# Altium schematic sheet IO.SchDoc
size A3; SheetNumber: 11; SheetTotal: 13
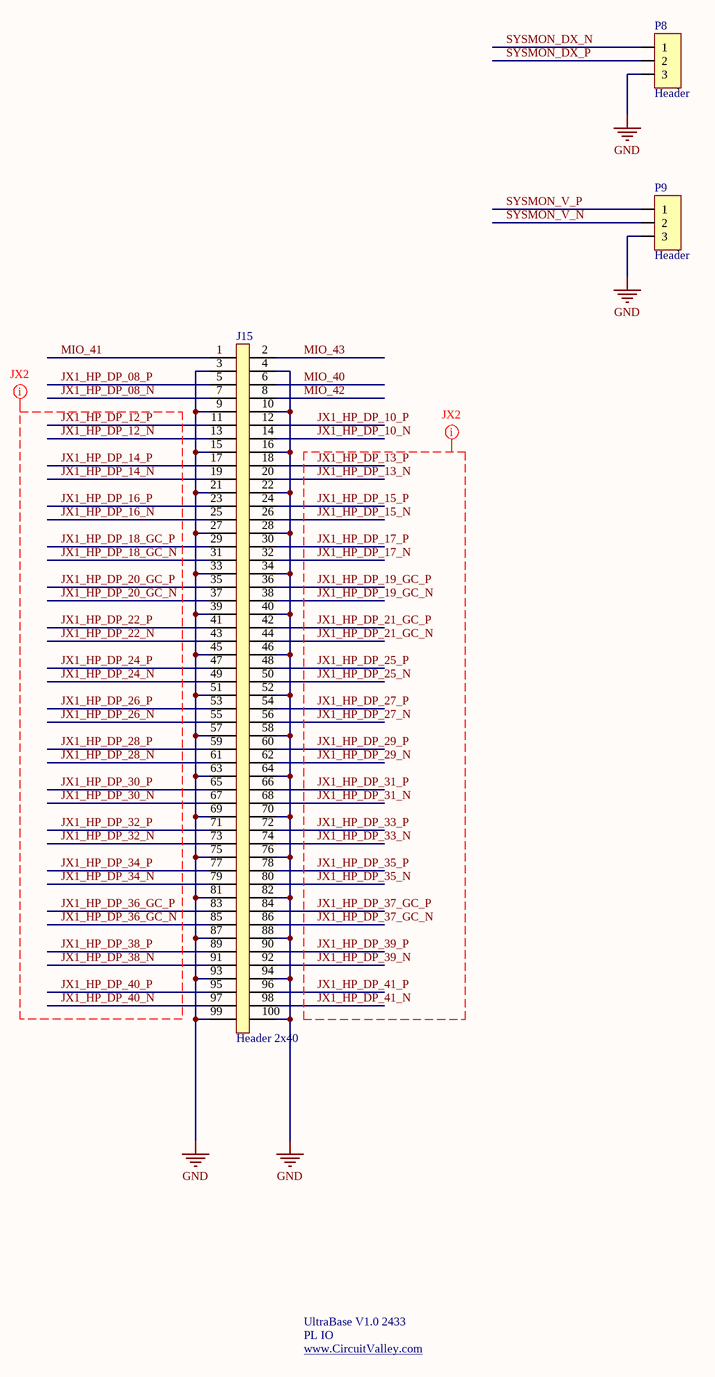
[diagram p0: IO.SchDoc]

## Parts
J15  Header 2x40  [Header_2x50]
P8  Header  [Header3x]
P9  Header  [Header3x]

## Nets
GND: J15.3 J15.4 J15.9 J15.10 J15.15 J15.16 J15.21 J15.22 J15.27 J15.28 J15.33 J15.34 J15.39 J15.40 J15.45 J15.46 J15.51 J15.52 J15.57 J15.58 J15.63 J15.64 J15.69 J15.70 J15.75 J15.76 J15.81 J15.82 J15.87 J15.88 J15.93 J15.94 J15.99 J15.100 P8.3 P9.3
JX1_HP_DP_08_N: J15.7
JX1_HP_DP_08_P: J15.5
JX1_HP_DP_10_N: J15.14
JX1_HP_DP_10_P: J15.12
JX1_HP_DP_12_N: J15.13
JX1_HP_DP_12_P: J15.11
JX1_HP_DP_13_N: J15.20
JX1_HP_DP_13_P: J15.18
JX1_HP_DP_14_N: J15.19
JX1_HP_DP_14_P: J15.17
JX1_HP_DP_15_N: J15.26
JX1_HP_DP_15_P: J15.24
JX1_HP_DP_16_N: J15.25
JX1_HP_DP_16_P: J15.23
JX1_HP_DP_17_N: J15.32
JX1_HP_DP_17_P: J15.30
JX1_HP_DP_18_GC_N: J15.31
JX1_HP_DP_18_GC_P: J15.29
JX1_HP_DP_19_GC_N: J15.38
JX1_HP_DP_19_GC_P: J15.36
JX1_HP_DP_20_GC_N: J15.37
JX1_HP_DP_20_GC_P: J15.35
JX1_HP_DP_21_GC_N: J15.44
JX1_HP_DP_21_GC_P: J15.42
JX1_HP_DP_22_N: J15.43
JX1_HP_DP_22_P: J15.41
JX1_HP_DP_24_N: J15.49
JX1_HP_DP_24_P: J15.47
JX1_HP_DP_25_N: J15.50
JX1_HP_DP_25_P: J15.48
JX1_HP_DP_26_N: J15.55
JX1_HP_DP_26_P: J15.53
JX1_HP_DP_27_N: J15.56
JX1_HP_DP_27_P: J15.54
JX1_HP_DP_28_N: J15.61
JX1_HP_DP_28_P: J15.59
JX1_HP_DP_29_N: J15.62
JX1_HP_DP_29_P: J15.60
JX1_HP_DP_30_N: J15.67
JX1_HP_DP_30_P: J15.65
JX1_HP_DP_31_N: J15.68
JX1_HP_DP_31_P: J15.66
JX1_HP_DP_32_N: J15.73
JX1_HP_DP_32_P: J15.71
JX1_HP_DP_33_N: J15.74
JX1_HP_DP_33_P: J15.72
JX1_HP_DP_34_N: J15.79
JX1_HP_DP_34_P: J15.77
JX1_HP_DP_35_N: J15.80
JX1_HP_DP_35_P: J15.78
JX1_HP_DP_36_GC_N: J15.85
JX1_HP_DP_36_GC_P: J15.83
JX1_HP_DP_37_GC_N: J15.86
JX1_HP_DP_37_GC_P: J15.84
JX1_HP_DP_38_N: J15.91
JX1_HP_DP_38_P: J15.89
JX1_HP_DP_39_N: J15.92
JX1_HP_DP_39_P: J15.90
JX1_HP_DP_40_N: J15.97
JX1_HP_DP_40_P: J15.95
JX1_HP_DP_41_N: J15.98
JX1_HP_DP_41_P: J15.96
MIO_40: J15.6
MIO_41: J15.1
MIO_42: J15.8
MIO_43: J15.2
SYSMON_DX_N: P8.1
SYSMON_DX_P: P8.2
SYSMON_V_N: P9.2
SYSMON_V_P: P9.1

## Layout directives
net class JX2: JX1_HP_DP_12_N, JX1_HP_DP_12_P, JX1_HP_DP_13_N, JX1_HP_DP_13_P, JX1_HP_DP_14_N, JX1_HP_DP_14_P, JX1_HP_DP_15_N, JX1_HP_DP_15_P, JX1_HP_DP_16_N, JX1_HP_DP_16_P, JX1_HP_DP_17_N, JX1_HP_DP_17_P, JX1_HP_DP_18_GC_N, JX1_HP_DP_18_GC_P, JX1_HP_DP_19_GC_N, JX1_HP_DP_19_GC_P, JX1_HP_DP_20_GC_N, JX1_HP_DP_20_GC_P, JX1_HP_DP_21_GC_N, JX1_HP_DP_21_GC_P, JX1_HP_DP_22_N, JX1_HP_DP_22_P, JX1_HP_DP_24_N, JX1_HP_DP_24_P, JX1_HP_DP_25_N, JX1_HP_DP_25_P, JX1_HP_DP_26_N, JX1_HP_DP_26_P, JX1_HP_DP_27_N, JX1_HP_DP_27_P, JX1_HP_DP_28_N, JX1_HP_DP_28_P, JX1_HP_DP_29_N, JX1_HP_DP_29_P, JX1_HP_DP_30_N, JX1_HP_DP_30_P, JX1_HP_DP_31_N, JX1_HP_DP_31_P, JX1_HP_DP_32_N, JX1_HP_DP_32_P, JX1_HP_DP_33_N, JX1_HP_DP_33_P, JX1_HP_DP_34_N, JX1_HP_DP_34_P, JX1_HP_DP_35_N, JX1_HP_DP_35_P, JX1_HP_DP_36_GC_N, JX1_HP_DP_36_GC_P, JX1_HP_DP_37_GC_N, JX1_HP_DP_37_GC_P, JX1_HP_DP_38_N, JX1_HP_DP_38_P, JX1_HP_DP_39_N, JX1_HP_DP_39_P, JX1_HP_DP_40_N, JX1_HP_DP_40_P, JX1_HP_DP_41_N, JX1_HP_DP_41_P

## Notes on the sheet
- UltraBase V1.0 2433
- PL IO
- www.CircuitValley.com <http://www.CircuitValley.com>

## Library data of the parts
J15 = Header_2x50
P8 P9 = Header_3Pin: 3 Pin Header